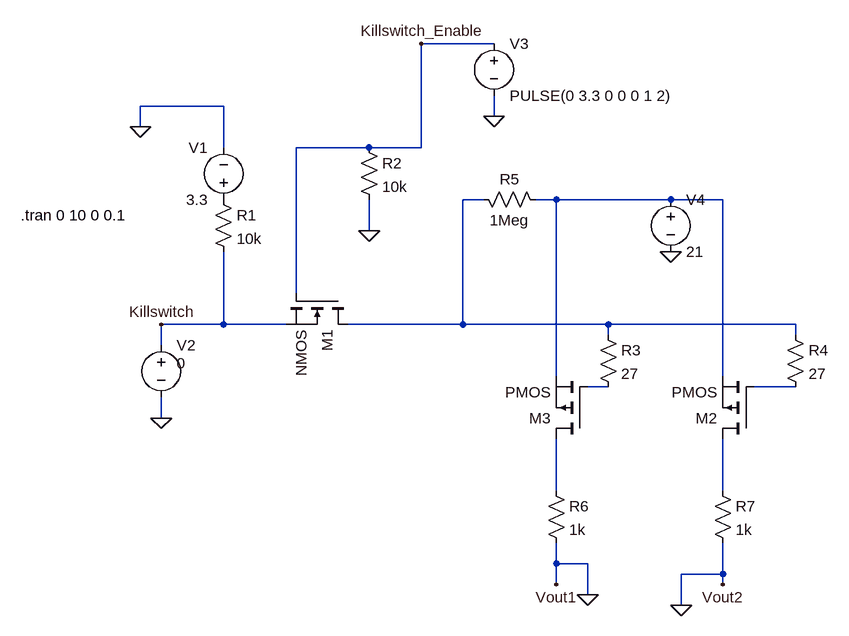
[diagram p0: schematic LTSpice_Simulation_KillSwitch.asc]
LTSpice_Simulation_KillSwitch.asc, the LTspice schematic file:
Version 4
SHEET 1 880 680
WIRE -240 -368 -352 -368
WIRE -656 -272 -784 -272
WIRE -240 -256 -240 -288
WIRE -784 -240 -784 -272
WIRE -656 -208 -656 -272
WIRE -432 -208 -544 -208
WIRE -352 -208 -352 -368
WIRE -352 -208 -432 -208
WIRE -256 -128 -288 -128
WIRE -144 -128 -176 -128
WIRE 32 -128 -144 -128
WIRE 112 -128 32 -128
WIRE -432 -80 -432 -128
WIRE -544 16 -544 -208
WIRE -656 64 -656 -48
WIRE -656 64 -752 64
WIRE -560 64 -656 64
WIRE -288 64 -288 -128
WIRE -288 64 -464 64
WIRE -64 64 -288 64
WIRE 224 64 -64 64
WIRE -64 80 -64 64
WIRE 224 80 224 64
WIRE -752 96 -752 64
WIRE -144 144 -144 -128
WIRE 112 144 112 -128
WIRE -64 160 -96 160
WIRE 224 160 160 160
WIRE -752 208 -752 176
WIRE -144 320 -144 240
WIRE 112 320 112 240
WIRE -144 432 -144 400
WIRE -96 432 -144 432
WIRE 112 448 112 400
WIRE 112 448 48 448
WIRE -144 464 -144 432
WIRE 112 464 112 448
WIRE -96 480 -96 432
WIRE 48 496 48 448
FLAG -432 -80 0
FLAG -784 -240 0
FLAG -752 208 0
FLAG -240 -256 0
FLAG -144 464 Vout1
FLAG 112 464 Vout2
FLAG 32 -48 0
FLAG -752 64 Killswitch
FLAG -352 -368 Killswitch_Enable
FLAG -96 480 0
FLAG 48 496 0
SYMBOL nmos -464 16 R90
SYMATTR InstName M1
SYMBOL pmos 160 240 R180
SYMATTR InstName M2
SYMBOL pmos -96 240 R180
SYMATTR InstName M3
SYMBOL res -672 -144 R0
SYMATTR InstName R1
SYMATTR Value 10k
SYMBOL res -448 -224 R0
SYMATTR InstName R2
SYMATTR Value 10k
SYMBOL res -80 64 R0
SYMATTR InstName R3
SYMATTR Value 27
SYMBOL res 208 64 R0
SYMATTR InstName R4
SYMATTR Value 27
SYMBOL res -160 -112 M270
WINDOW 0 32 56 VTop 2
WINDOW 3 0 56 VBottom 2
SYMATTR InstName R5
SYMATTR Value 1Meg
SYMBOL voltage -656 -112 R180
WINDOW 0 24 96 Left 2
WINDOW 3 24 16 Left 2
WINDOW 123 0 0 Left 0
WINDOW 39 0 0 Left 0
SYMATTR InstName V1
SYMATTR Value 3.3
SYMBOL voltage -752 80 R0
WINDOW 3 24 44 Left 2
WINDOW 123 0 0 Left 0
WINDOW 39 0 0 Left 0
SYMATTR InstName V2
SYMATTR Value 0
SYMBOL voltage -240 -384 R0
WINDOW 123 0 0 Left 0
WINDOW 39 0 0 Left 0
SYMATTR InstName V3
SYMATTR Value PULSE(0 3.3 0 0 0 1 2)
SYMBOL voltage 32 -144 R0
WINDOW 123 0 0 Left 0
WINDOW 39 0 0 Left 0
SYMATTR InstName V4
SYMATTR Value 21
SYMBOL res -160 304 R0
SYMATTR InstName R6
SYMATTR Value 1k
SYMBOL res 96 304 R0
SYMATTR InstName R7
SYMATTR Value 1k
TEXT -968 -104 Left 2 !.tran 0 10 0 0.1

The netlist it stands for:
* LTSpice_Simulation_KillSwitch.asc
M1 N001 Killswitch_Enable Killswitch Killswitch NMOS
M2 N006 N004 N002 N002 PMOS
M3 N005 N003 N002 N002 PMOS
R1 P001 Killswitch 10k
R2 Killswitch_Enable 0 10k
R3 N001 N003 27
R4 N001 N004 27
R5 N002 N001 1Meg
V1 P001 0 3.3
V2 Killswitch 0 0
V3 Killswitch_Enable 0 PULSE(0 3.3 0 0 0 1 2)
V4 N002 0 21
R6 N005 0 1k
R7 N006 0 1k
.model NMOS NMOS
.model PMOS PMOS
.lib standard.mos
.tran 0 10 0 0.1
.backanno
.end